# EAGLE design catropy (EAGLE 9.6.2)
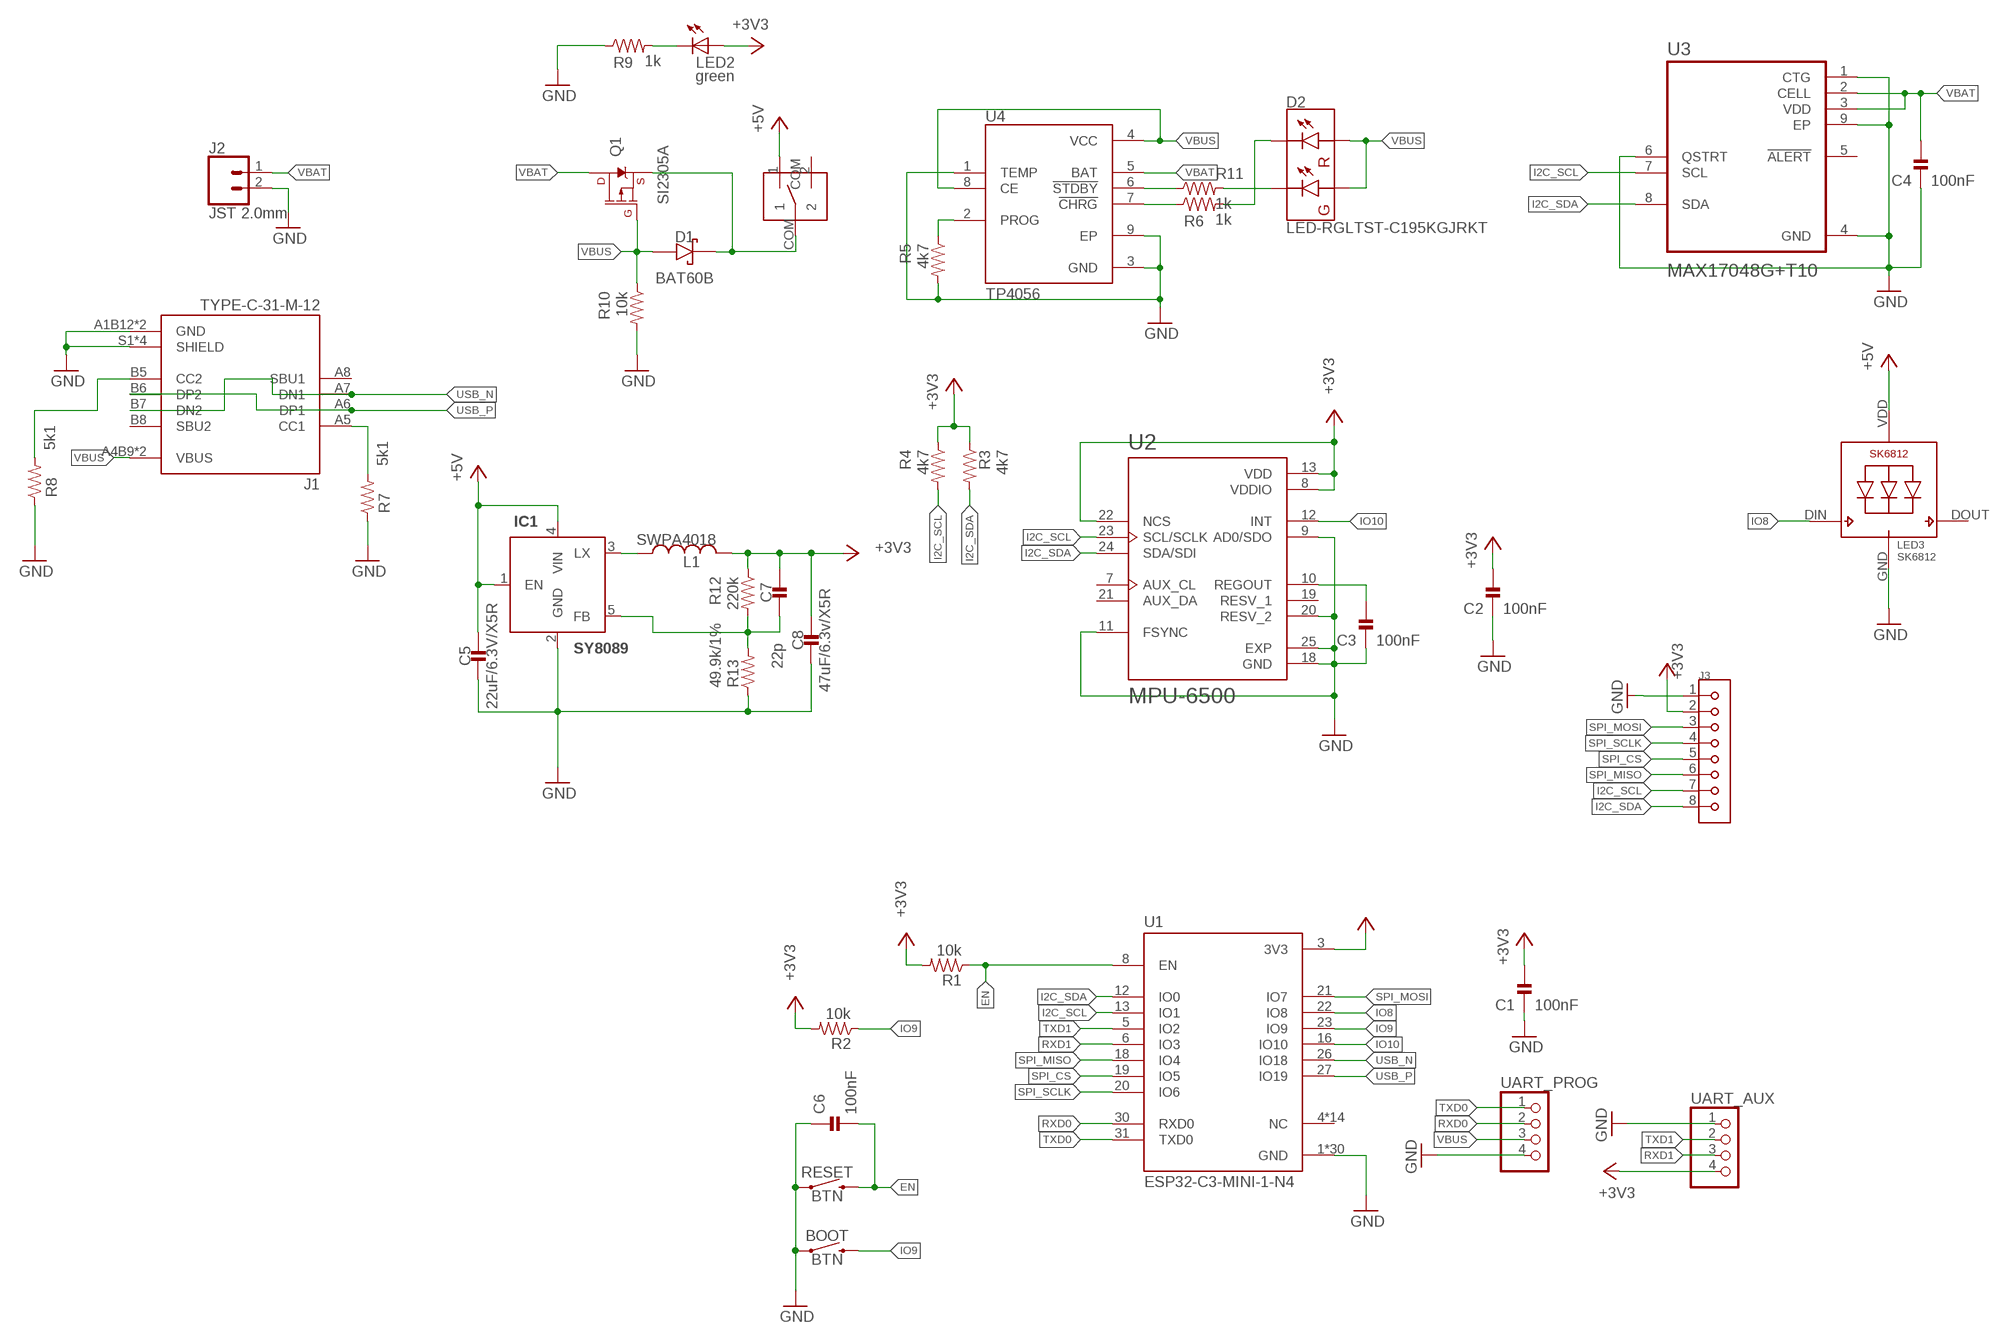
[diagram p0: schematic, sheet 1]

## Parts
BOOT  BTN  MOMENTARY-SWITCH-SPST-SMD-6.0X3.5MM  [TACTILE_SWITCH_SMD_6.0X3.5MM]
C1  100nF  CAPACITOR0402_CAP  [0402_CAP]
C2  100nF  CAPACITOR0402_CAP  [0402_CAP]
C3  100nF  CAPACITOR0402_CAP  [0402_CAP]
C4  100nF  CAPACITOR0402_CAP  [0402_CAP]
C5  22uF/6.3V/X5R  CAPACITOR0603_CAP  [0603_CAP]
C6  100nF  CAPACITOR0402_CAP  [0402_CAP]
C7  22p  CAPACITOR0402_CAP  [0402_CAP]
C8  47uF/6.3v/X5R  CAPACITOR0805_CAP  [0805_CAP]
D1  BAT60B  DIODE_SCHOTTKYSOD323  [SOD323]
D2  LED-RGLTST-C195KGJRKT  [LTST-C195KGJRKT]
IC1  SY8089  [SOT23-5]
J1  TYPE-C-31-M-12  [HRO_TYPE-C-31-M-12]
J2  JST 2.0mm  CONN_02-JST-2MM-SMT  [JST-2-SMD]
J3  SM08B-SRSS-TB(LF)(SN)  [JST_SM08B-SRSS-TB(LF)(SN)]
L1  SWPA4018  SWPA40XX  [SWPA40XX]
LED2  green  LEDCHIPLED_0603  [CHIPLED_0603]
LED3  SK6812  SK6812_EC3210R  [LED_EC3210R]
Q1  SI2305A  MOSFET_PCH-SI2309DS  [SOT23-3]
R1  10k  RESISTOR0402_RES  [0402_RES]
R2  10k  RESISTOR0402_RES  [0402_RES]
R3  4k7  RESISTOR0402_RES  [0402_RES]
R4  4k7  RESISTOR0402_RES  [0402_RES]
R5  4k7  RESISTOR0402_RES  [0402_RES]
R6  1k  RESISTOR0402_RES  [0402_RES]
R7  5k1  RESISTOR0402_RES  [0402_RES]
R8  5k1  RESISTOR0402_RES  [0402_RES]
R9  1k  RESISTOR0402_RES  [0402_RES]
R10  10k  RESISTOR0402_RES  [0402_RES]
R11  1k  RESISTOR0402_RES  [0402_RES]
R12  220k  RESISTOR0402_RES  [0402_RES]
R13  49.9k/1%  RESISTOR0402_RES  [0402_RES]
RESET  BTN  MOMENTARY-SWITCH-SPST-SMD-6.0X3.5MM  [TACTILE_SWITCH_SMD_6.0X3.5MM]
U1  ESP32-C3-MINI-1-N4  [XCVR_ESP32-C3-MINI-1-N4]
U2  MPU-6500  [QFN40P300X300X95-25N]
U3  MAX17048G+T10  [SON50P200X200X80-9N]
U4  TP4056  [SOP127P600X175-9N]
U$1  SK12D07VG4  [SK12D07VG4]
UART_AUX  PINHD-1X4  [1X04]
UART_PROG  PINHD-1X4  [1X04]

## Nets
5V_AUX: D1.P$1(CATHODE) Q1.2(S) U$1.COM
+3V3: C1.2 C2.2 C7.1 C8.P$1 J3.2 L1.P$2 LED2.A R1.2 R2.2 R3.1 R4.1 R12.1 U1.3(3V3) U2.8(VDDIO) U2.13(VDD) U2.22(NCS) UART_AUX.4
+5V: C5.1 IC1.1(EN) IC1.4(VIN) LED3.VDD U$1.1
EN: C6.2 R1.1 RESET.2 U1.8(EN)
GND: BOOT.1 C1.1 C2.1 C3.1 C4.1 C5.2 C6.1 C8.P$2 IC1.2(GND) J1.A1B12(GND) J1.B1A12(GND) J1.S1(SHIELD) J1.S2(SHIELD) J1.S3(SHIELD) J1.S4(SHIELD) J2.2 J3.1 LED3.GND R5.2 R7.1 R8.1 R9.1 R10.2 R13.1 RESET.1 U1.1(GND) U1.2(GND) U1.11(GND) U1.14(GND) U1.36(GND) U1.37(GND) U1.38(GND) U1.39(GND) U1.40(GND) U1.41(GND) U1.42(GND) U1.43(GND) U1.44(GND) U1.45(GND) U1.46(GND) U1.47(GND) U1.48(GND) U1.49_1(GND) U1.49_2(GND) U1.49_3(GND) U1.49_4(GND) U1.49_5(GND) U1.49_6(GND) U1.49_7(GND) U1.49_8(GND) U1.49_9(GND) U1.50(GND) U1.51(GND) U1.52(GND) U1.53(GND) U2.9(AD0/SDO) U2.11(FSYNC) U2.18(GND) U2.20(RESV_2) U2.25(EXP) U3.1(CTG) U3.4(GND) U3.6(QSTRT) U3.9(EP) U4.1(TEMP) U4.3(GND) U4.9(EP) UART_AUX.1 UART_PROG.4
I2C_SCL: J3.7 R4.2 U1.13(IO1) U2.23(SCL/SCLK) U3.7(SCL)
I2C_SDA: J3.8 R3.2 U1.12(IO0) U2.24(SDA/SDI) U3.8(SDA)
IO8: LED3.DIN(DI) U1.22(IO8)
IO9: BOOT.2 R2.1 U1.23(IO9)
IO10: U1.16(IO10) U2.12(INT)
N$1: R5.1 U4.2(PROG)
N$2: R6.1 U4.7(!CHRG)
N$3: J1.A5(CC1) R7.2
N$4: R11.1 U4.6(!STDBY)
N$5: D2.P$3(GC) R11.2
N$6: C7.2 IC1.5(FB) R12.2 R13.2
N$7: C3.2 U2.10(REGOUT)
N$8: IC1.3(LX) L1.P$1
N$12: D2.P$4(RC) R6.2
N$13: LED2.C R9.2
N$15: J1.B5(CC2) R8.2
RXD0: U1.30(RXD0) UART_PROG.2
RXD1: U1.6(IO3) UART_AUX.3
SPI_CS: J3.5 U1.19(IO5)
SPI_MISO: J3.6 U1.18(IO4)
SPI_MOSI: J3.3 U1.21(IO7)
SPI_SCLK: J3.4 U1.20(IO6)
TXD0: U1.31(TXD0) UART_PROG.1
TXD1: U1.5(IO2) UART_AUX.2
USB_N: J1.A7(DN1) J1.B7(DN2) U1.26(IO18)
USB_P: J1.A6(DP1) J1.B6(DP2) U1.27(IO19)
VBAT: C4.2 J2.1 Q1.3(D) U3.2(CELL) U3.3(VDD) U4.5(BAT)
VBUS: D1.P$2(ANODE) D2.P$1(GA) D2.P$2(RA) J1.A4B9(VBUS) J1.B4A9(VBUS) Q1.1(G) R10.1 U4.4(VCC) U4.8(CE) UART_PROG.3
Unconnected: J1.A8(SBU1) J1.B8(SBU2) LED3.DOUT(DO) U1.4(NC) U1.7(NC) U1.9(NC) U1.10(NC) U1.15(NC) U1.17(NC) U1.24(NC) U1.25(NC) U1.28(NC) U1.29(NC) U1.32(NC) U1.33(NC) U1.34(NC) U1.35(NC) U2.7(AUX_CL) U2.19(RESV_1) U2.21(AUX_DA) U3.5(!ALERT) U$1.2

## Library data of the parts
BOOT RESET = SparkFun-Switches:MOMENTARY-SWITCH-SPST: Momentary Switch (Pushbutton) - SPST Normally-open (NO) SPST momentary switches (buttons, pushbuttons). Variants PTH-12MM - 12mm square, through-hole Momentary Pushbutton Switch - 12mm Square <https://www.sparkfun.com/products/9190> (COM-09190) PTH-6.0MM, PTH-6.0MM-KIT - 6.0mm square, through-hole Mini Pushbutton Switch <https://www.sparkfun.com/products/97> (COM-00097) KIT package intended for soldering kit's - only one side of pads' copper is exposed. PTH-RIGHT-ANGLE-KIT - Right-angle, through-hole Right Angle Tactile Button <https://www.sparkfun.com/products/10791> - Used on SparkFun BigTime Watch Kit <https://www.sparkfun.com/products/11734> SMD-12MM - 12mm square, surface-mount Tactile Button - SMD (12mm) <https://www.sparkfun.com/products/12993> (COM-12993) Used on SparkFun PicoBoard <https://www.sparkfun.com/products/11888> SMD-4.5MM - 4.5mm Square Trackball Switch Used on SparkFun Blackberry Trackballer Breakout <https://www.sparkfun.com/products/13169> SMD-4.6MMX2.8MM - 4.60mm x 2.80mm, surface mount Used on SparkFun SAMD21 Mini Breakout <https://www.sparkfun.com/products/13664> SMD-5.2MM, SMD-5.2-REDUNDANT - 5.2mm square, surface-mount Mini Pushbutton Switch - SMD <https://www.sparkfun.com/products/8720> (COM-08720) Used on Arduino Pro Mini <https://www.sparkfun.com/products/11114> REDUNDANT package connects both switch circuits together SMD-6.0X3.5MM - 6.0 x 3.5mm, surface mount Momentary Reset Switch SMD <https://www.sparkfun.com/products/8229> (COM-08229) SMD-6.2MM-TALL - 6.2mm square, surface mount Tactile Button - SMD (6mm) <https://www.sparkfun.com/products/12992> Used on SparkFun Digital Sandbox <https://www.sparkfun.com/products/12651> SMD-RIGHT-ANGLE - Right-angle, surface mount Used on SparkFun Block for Intel® Edison - Arduino <https://www.sparkfun.com/products/13036>; LCSC_PART: C118141; PROD_ID: SWCH-00815; SF_SKU: COM-08229
C1-C8 = passives:CAPACITOR: SMD Capacitor
D1 = passives:DIODE_SCHOTTKY; LCSC_PART: C22638
D2 = SparkFun-LED:LED-RG: LiteOn Technology Corporation LTST-C195KGJRKT - LED GREEN/RED CLEAR 0606 SMD Color: Red/Green Lens Transparency: Clear Lens Style/Size: Rectangle with Flat top, 1.10 x 1.5 mm mC Rating45mcd Red, 35 mcd Green Current: 20mA Red, 20mA Green Forward Voltage: 2V Red, 2V Green Packages: 0606 SparkFun Products: Electric Imp imp002 Breakout <[https://www.sparkfun.com/products/12958]>; LCSC_PART: C125104; PROD_ID: DIO-12140
IC1 = SY8089:SY8089; LCSC_PART: C78988
J1 = TYPE-C-31-M-12:TYPE-C-31-M-12: USB Connectors 24 Receptacle 1 8.94*7.3mm RoHS Check availability <https://pricing.snapeda.com/parts/TYPE-C-31-M-12/HRO%20Electronics%20Co.%2C%20Ltd./view-part?ref=eda>; AVAILABILITY: Not in stock; DESCRIPTION: USB Connectors 24 Receptacle 1 8.94*7.3mm RoHS; LCSC_PART: C165948; MF: HRO Electronics Co., Ltd.; MP: TYPE-C-31-M-12; PACKAGE: Package; PRICE: None
J2 = SparkFun-Connectors:CONN_02: Multi connection point. Often used as Generic Header-pin footprint for 0.1 inch spaced/style header connections On any of the 0.1 inch spaced packages, you can populate with these: Break Away Headers - Straight <https://www.sparkfun.com/products/116> (PRT-00116) Break Away Male Headers - Right Angle <https://www.sparkfun.com/products/553> (PRT-00553) Female Headers <https://www.sparkfun.com/products/115> (PRT-00115) Break Away Headers - Machine Pin <https://www.sparkfun.com/products/117> (PRT-00117) Break Away Female Headers - Swiss Machine Pin <https://www.sparkfun.com/products/743> (PRT-00743) For SCREWTERMINALS and SPRING TERMINALS visit here: Screw Terimnals on SparkFun.com <https://www.sparkfun.com/search/results?term=Screw+Terminals> (5mm/3.5mm/2.54mm spacing) This device is also useful as a general connection point to wire up your design to another part of your project. Our various solder wires solder well into these plated through hole pads. Hook-Up Wire - Assortment (Stranded, 22 AWG) <https://www.sparkfun.com/products/11375> (PRT-11375) Hook-Up Wire - Assortment (Solid Core, 22 AWG) <https://www.sparkfun.com/products/11367> (PRT-11367) View the entire wire category on our website here <https://www.sparkfun.com/categories/141> Special notes: Molex polarized connector foot print use with: PRT-08233 with associated crimp pins and housings. 2.54_SCREWTERM for use with PRT-10571. 3.5mm Screw Terminal footprints for PRT-08084 5mm Screw Terminal footprints for use with PRT-08432; LCSC_PART: C3029440; PROD_ID: CONN-11443
J3 = SM08B-SRSS-TB_LF__SN_:SM08B-SRSS-TB(LF)(SN): SH Series 8 Position 1 mm Pitch Surface Mount Side Entry Shrouded Header Check availability <https://pricing.snapeda.com/parts/SM08B-SRSS-TB%28LF%29%28SN%29/JST%20Sales/view-part?ref=eda>; AVAILABILITY: In Stock; DESCRIPTION: Connector Header Surface Mount, Right Angle 8 position 0.039 (1.00mm); LCSC_PART: C160407; MF: JST Sales; MP: SM08B-SRSS-TB(LF)(SN); PACKAGE: None; PRICE: None; PURCHASE-URL: https://pricing.snapeda.com/search/part/SM08B-SRSS-TB(LF)(SN)/?ref=eda
L1 = swpa_inductor:SWPA40XX; LCSC_PART: C50543
LED2 = led:LED: LED OSRAM: - CHIPLED LG R971, LG N971, LY N971, LG Q971, LY Q971, LO R971, LY R971 LH N974, LH R974 LS Q976, LO Q976, LY Q976 LO Q996 - Hyper CHIPLED LW Q18S LB Q993, LB Q99A, LB R99A - SideLED LS A670, LO A670, LY A670, LG A670, LP A670 LB A673, LV A673, LT A673, LW A673 LH A674 LY A675 LS A676, LA A676, LO A676, LY A676, LW A676 LS A679, LY A679, LG A679 - Hyper Micro SIDELED® LS Y876, LA Y876, LO Y876, LY Y876 LT Y87S - SmartLED LW L88C, LW L88S LB L89C, LB L89S, LG L890 LS L89K, LO L89K, LY L89K LS L896, LA L896, LO L896, LY L896 - TOPLED LS T670, LO T670, LY T670, LG T670, LP T670 LSG T670, LSP T670, LSY T670, LOP T670, LYG T670 LG T671, LOG T671, LSG T671 LB T673, LV T673, LT T673, LW T673 LH T674 LS T676, LA T676, LO T676, LY T676, LB T676, LH T676, LSB T676, LW T676 LB T67C, LV T67C, LT T67C, LS T67K, LO T67K, LY T67K, LW E67C LS E67B, LA E67B, LO E67B, LY E67B, LB E67C, LV E67C, LT E67C LW T67C LS T679, LY T679, LG T679 LS T770, LO T770, LY T770, LG T770, LP T770 LB T773, LV T773, LT T773, LW T773 LH T774 LS E675, LA E675, LY E675, LS T675 LS T776, LA T776, LO T776, LY T776, LB T776 LHGB T686 LT T68C, LB T68C - Hyper Mini TOPLED® LB M676 - Mini TOPLED Santana® LG M470 LS M47K, LO M47K, LY M47K Source: http://www.osram.convergy.de LUXEON: - LUMILED® LXK2-PW12-R00, LXK2-PW12-S00, LXK2-PW14-U00, LXK2-PW14-V00 LXK2-PM12-R00, LXK2-PM12-S00, LXK2-PM14-U00 LXK2-PE12-Q00, LXK2-PE12-R00, LXK2-PE12-S00, LXK2-PE14-T00, LXK2-PE14-U00 LXK2-PB12-K00, LXK2-PB12-L00, LXK2-PB12-M00, LXK2-PB14-N00, LXK2-PB14-P00, LXK2-PB14-Q00 LXK2-PR12-L00, LXK2-PR12-M00, LXK2-PR14-Q00, LXK2-PR14-R00 LXK2-PD12-Q00, LXK2-PD12-R00, LXK2-PD12-S00 LXK2-PH12-R00, LXK2-PH12-S00 LXK2-PL12-P00, LXK2-PL12-Q00, LXK2-PL12-R00 Source: www.luxeon.com KINGBRIGHT: KA-3528ASYC Source: www.kingbright.com; LCSC_PART: C72043
LED3 = SK6812:SK6812; LCSC_PART: C2890041
Q1 = SparkFun-DiscreteSemi:MOSFET_PCH: P-channel MOSFETs Voltage controlled devices that allow control of high current outputs. SparkFun Products: SparkFun ESP32 Thing <https://www.sparkfun.com/products/13907> SparkFun ESP8266 Thing <https://www.sparkfun.com/products/13231> SparkFun Pi Servo HAT V2 <https://www.sparkfun.com/products/15316> DMG2305UX-7 (20V/4.2A/SOT23-3); LCSC_PART: C347488; PROD_ID: TRANS-08285; VALUE: 1.1A/60V/600mΩ
R1-R12 = passives:RESISTOR: Resistor Basic schematic elements and footprints for 0201, 0402, 0603, 1206, and PTH resistors.
R13 = passives:RESISTOR: Resistor Basic schematic elements and footprints for 0201, 0402, 0603, 1206, and PTH resistors.; LCSC_PART: C208898
U1 = ESP32-C3-MINI-1-N4:ESP32-C3-MINI-1-N4: Check availability <https://pricing.snapeda.com/parts/ESP32-C3-MINI-1-N4/Espressif%20Systems/view-part?ref=eda>; AVAILABILITY: In Stock; DESCRIPTION: Bluetooth, WiFi 802.11b/g/n, Bluetooth v5.0 Transceiver Module 2.412GHz ~ 2.484GHz PCB Trace Surface Mount; LCSC_PART: C2838502; MF: Espressif Systems; MP: ESP32-C3-MINI-1-N4; PACKAGE: SMD-53 Espressif Systems; PRICE: None; PURCHASE-URL: https://pricing.snapeda.com/search/part/ESP32-C3-MINI-1-N4/?ref=eda
U2 = MPU-6500:MPU-6500: Accelerometer, Gyroscope, 6 Axis Sensor I²C, SPI Output Check availability <https://pricing.snapeda.com/parts/MPU-6500/TDK%20InvenSense/view-part?ref=eda>; AVAILABILITY: In Stock; DESCRIPTION: Accelerometer, Gyroscope, 6 Axis Sensor I²C, SPI Output; LCSC_PART: C50278; MF: TDK InvenSense; MP: MPU-6500; PACKAGE: None; PRICE: None; PURCHASE-URL: https://pricing.snapeda.com/search/part/MPU-6500/?ref=eda
U3 = MAX17048G_T10:MAX17048G+T10: Check availability <https://pricing.snapeda.com/parts/MAX17048G%2BT10/Analog%20Devices/view-part?ref=eda>; AVAILABILITY: In Stock; DESCRIPTION: 3µA 1-Cell/2-Cell Fuel Gauge with ModelGauge; LCSC_PART: C2682616; MF: Analog Devices; MP: MAX17048G+T10; PACKAGE: TDFN-8 Maxim; PRICE: None; PURCHASE-URL: https://pricing.snapeda.com/search/part/MAX17048G+T10/?ref=eda
U4 = TP4056:TP4056: Complete single cell Li-Ion battery with a constant current / constant voltage linear charger Check availability <https://pricing.snapeda.com/parts/TP4056/NanJing%20Top%20Power%20ASIC%20Corp./view-part?ref=eda>; AVAILABILITY: Not in stock; DESCRIPTION: Complete single cell Li-Ion battery with a constant current / constant voltage linear charger; MF: NanJing Top Power ASIC Corp.; MP: TP4056; PACKAGE: Package; PRICE: None
U$1 = SK12D07VG4:SK12D07VG4: SPDT switch LCSC very cheap Check availability <https://pricing.snapeda.com/parts/SK12D07VG4/C%26K/view-part?ref=eda>; AVAILABILITY: In Stock; DESCRIPTION: Switch Slide ON ON SPDT Side Slide 0.3A 30VDC PC Pins Bracket Mount/Through Hole Bulk; LCSC_PART: C393937; MF: C&K; MP: SK12D07VG4; PACKAGE: None; PRICE: None; PURCHASE-URL: https://pricing.snapeda.com/search/part/SK12D07VG4/?ref=eda
UART_AUX UART_PROG = pinhead:PINHD-1X4: PIN HEADER

## Net classes
0 default: width 0.152 mm
1 supply: width 0.203 mm

## Board
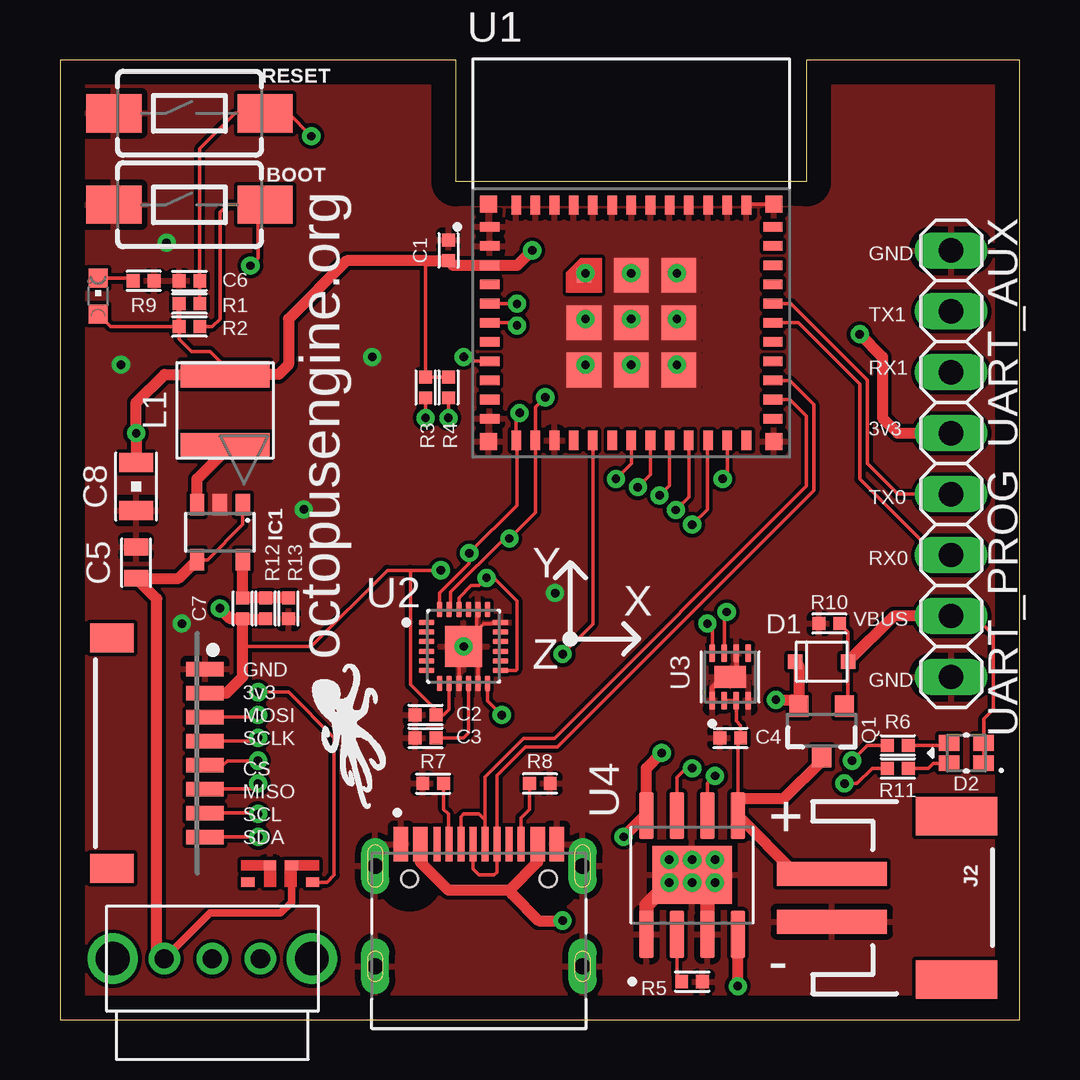
[diagram p1: board, top side]
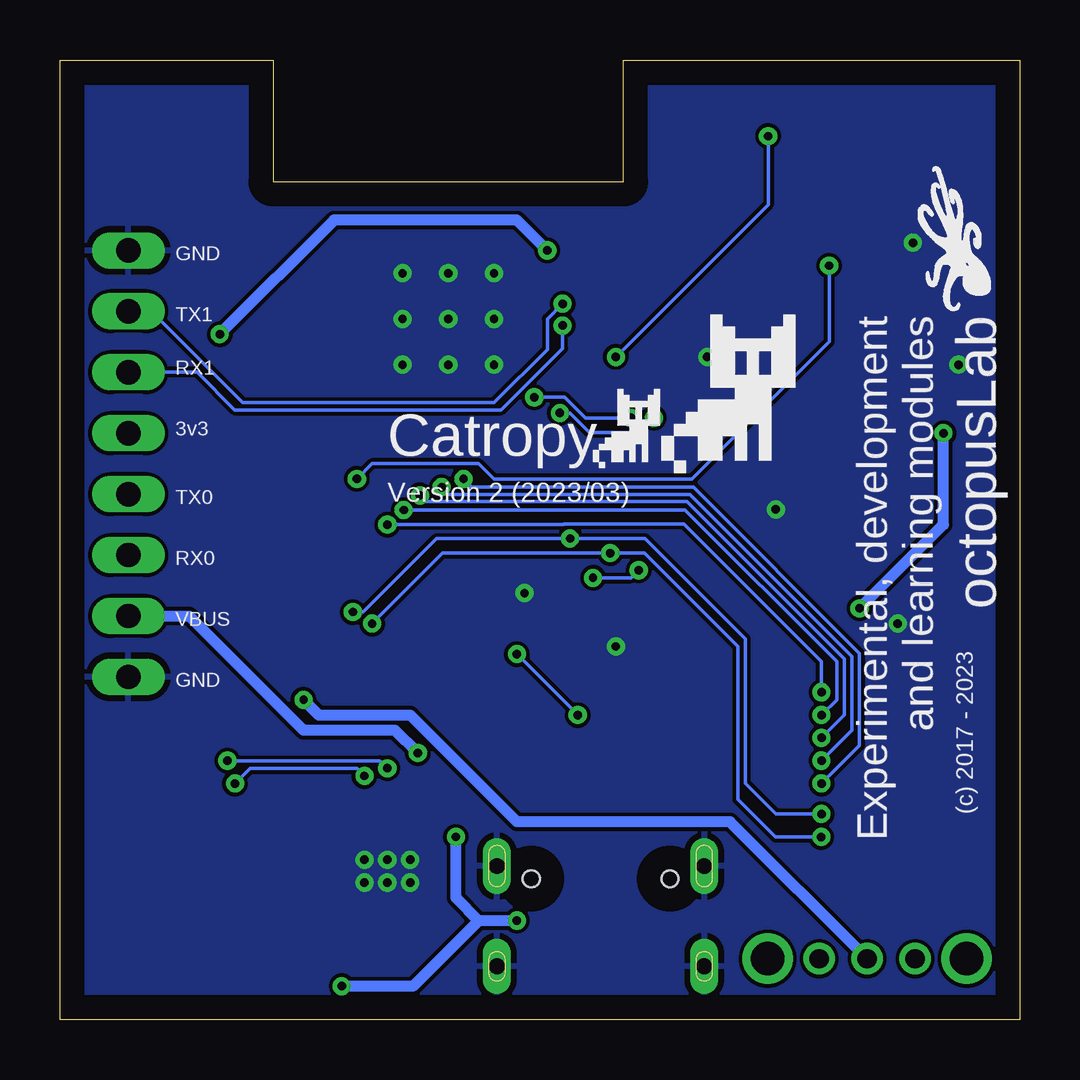
[diagram p2: board, bottom side, seen from below]

Size 40 x 40.01 mm. Coordinates in mm from the lower left corner, seen from the top.
Outline: 40,0 40,40 31.11,40.01 31.11,34.92 16.51,34.92 16.51,40 0,40 0,0 40,0
Copper layers (1*16): Top 0.035mm / dielectric 1.5mm / Bottom 0.035mm
Design rules "default *": minimum track width 6mil, minimum drill 0.35mm, track to track 6mil, track to pad 6mil, pad to pad 6mil, via to via 6mil, smd to smd 6mil, copper to edge 40mil, drill to drill 6mil, minimum pad ring 10mil, minimum via ring 8mil, stop-mask expansion 4mil, vias tented up to drill 15mil, thermal gap 10mil
Holes 3.5 mm at 24.54,45.66

### Footprints (pad centres in the part's own frame; a part is rotated, then mirrored left to right if it is on the bottom)
TACTILE_SWITCH_SMD_6.0X3.5MM = smd 2.3 x 1.6: 1 -3.15,0; 2 3.15,0
0402_CAP = smd 0.536 x 0.546: 1 -0.433,0; 2 0.433,0
0603_CAP = smd 0.7 x 1: 1 -0.65,0; 2 0.65,0
0805_CAP = smd 0.8 x 1.4: P$1 1,0; P$2 -1,0
SOD323 = smd 0.6 x 0.6: P$1 -1.1,0; P$2 1.1,0
LTST-C195KGJRKT = smd 0.85 x 0.65: P$1 -0.725,0.425; P$2 -0.725,-0.425; P$3 0.725,0.425; P$4 0.725,-0.425
SOT23-5 = smd 0.9 x 0.6: 1 -1.15,0.95; 2 -1.15,0; 3 -1.15,-0.95; 4 1.15,-0.95; 5 1.15,0.95
HRO_TYPE-C-31-M-12 = smd 0.6 x 1.45: A1B12 -3.25,5.095; A4B9 -2.45,5.095; B1A12 3.25,5.095; B4A9 2.45,5.095 | smd 0.3 x 1.45: A5 -1.25,5.095; A6 -0.25,5.095; A7 0.25,5.095; A8 1.25,5.095; B5 1.75,5.095; B6 0.75,5.095; B7 -0.75,5.095; B8 -1.75,5.095 | drill 0.65 pad 1.05 long: S1 -4.32,4.18; S2 4.32,4.18; S3 -4.32,0; S4 4.32,0 | hole 0.7: -2.89,3.65; 2.89,3.65
JST-2-SMD = smd 1 x 4.6: 1 -1,-3.7; 2 1,-3.7 | smd 1.6 x 3.4: NC1 -3.4,1.5; NC2 3.4,1.5
JST_SM08B-SRSS-TB(LF)(SN) = smd 0.6 x 1.55: 1 -3.5,4.775; 2 -2.5,4.775; 3 -1.5,4.775; 4 -0.5,4.775; 5 0.5,4.775; 6 1.5,4.775; 7 2.5,4.775; 8 3.5,4.775 | smd 1.2 x 1.8: P1 -4.8,0.9; P2 4.8,0.9
SWPA40XX = smd 1.1 x 3.7: P$1 -1.5,0.1; P$2 1.5,0.1
CHIPLED_0603 = smd 0.8 x 0.8: A 0,-0.75; C 0,0.75
LED_EC3210R = smd 0.55 x 0.4: DIN 1.325,-0.3; DOUT -1.375,-0.3; VDD 0.45,0.4 | smd 0.5 x 0.4: GND -0.45,0.4
SOT23-3 = smd 0.8 x 0.9: 1 -0.95,-1; 2 0.95,-1; 3 0,1.1
0402_RES = smd 0.536 x 0.546: 1 -0.433,0; 2 0.433,0
XCVR_ESP32-C3-MINI-1-N4 = smd 0.8 x 0.4: 1 -5.9,1.3; 2 -5.9,0.5; 3 -5.9,-0.3; 4 -5.9,-1.1; 5 -5.9,-1.9; 6 -5.9,-2.7; 7 -5.9,-3.5; 8 -5.9,-4.3; 9 -5.9,-5.1; 10 -5.9,-5.9; 11 -5.9,-6.7; 25 5.9,-6.7; 26 5.9,-5.9; 27 5.9,-5.1; 28 5.9,-4.3; 29 5.9,-3.5; 30 5.9,-2.7; 31 5.9,-1.9; 32 5.9,-1.1; 33 5.9,-0.3; 34 5.9,0.5; 35 5.9,1.3 | smd 0.4 x 0.8: 12 -4.8,-7.6; 13 -4,-7.6; 14 -3.2,-7.6; 15 -2.4,-7.6; 16 -1.6,-7.6; 17 -0.8,-7.6; 18 0,-7.6; 19 0.8,-7.6; 20 1.6,-7.6; 21 2.4,-7.6; 22 3.2,-7.6; 23 4,-7.6; 24 4.8,-7.6; 36 4.8,2.2; 37 4,2.2; 38 3.2,2.2; 39 2.4,2.2; 40 1.6,2.2; 41 0.8,2.2; 42 0,2.2; 43 -0.8,2.2; 44 -1.6,2.2; 45 -2.4,2.2; 46 -3.2,2.2; 47 -4,2.2; 48 -4.8,2.2 | smd 0.6 x 0.6: 49_1 -1.975,-0.725 | smd 1.45 x 1.45: 49_2 0,-0.725; 49_3 1.975,-0.725; 49_4 1.975,-2.7; 49_5 1.975,-4.675; 49_6 0,-4.675; 49_7 -1.975,-4.675; 49_8 -1.975,-2.7; 49_9 0,-2.7 | smd 0.7 x 0.7: 50 5.95,2.25; 51 5.95,-7.65; 52 -5.95,-7.65; 53 -5.95,2.25
QFN40P300X300X95-25N = smd 0.64 x 0.22: 1 -1.545,1; 2 -1.545,0.6; 3 -1.545,0.2; 4 -1.545,-0.2; 5 -1.545,-0.6; 6 -1.545,-1; 13 1.545,-1; 14 1.545,-0.6; 15 1.545,-0.2; 16 1.545,0.2; 17 1.545,0.6; 18 1.545,1 | smd 0.22 x 0.64: 7 -1,-1.545; 8 -0.6,-1.545; 9 -0.2,-1.545; 10 0.2,-1.545; 11 0.6,-1.545; 12 1,-1.545; 19 1,1.545; 20 0.6,1.545; 21 0.2,1.545; 22 -0.2,1.545; 23 -0.6,1.545; 24 -1,1.545 | smd 1.54 x 1.7: 25 0,0
SON50P200X200X80-9N = smd 0.76 x 0.27: 1 -0.985,0.75; 2 -0.985,0.25; 3 -0.985,-0.25; 4 -0.985,-0.75; 5 0.985,-0.75; 6 0.985,-0.25; 7 0.985,0.25; 8 0.985,0.75 | smd 0.9 x 1.3: 9 0,0
SOP127P600X175-9N = smd 1.97 x 0.6: 1 -2.475,1.905; 2 -2.475,0.635; 3 -2.475,-0.635; 4 -2.475,-1.905; 5 2.475,-1.905; 6 2.475,-0.635; 7 2.475,0.635; 8 2.475,1.905 | smd 2.413 x 3.302: 9 0,0
SK12D07VG4 = drill 0.8: 1 -2,0; 2 2,0; COM 0,0 | drill 1.4: M1 -4.15,0; M2 4.15,0
1X04 = drill 1.016 long: 1 -3.81,0; 2 -1.27,0; 3 1.27,0; 4 3.81,0

### Placement (x,y rotation side)
BOOT  5.4,33.97 0 top
C1  16.19,32.07 270 top
C2  15.24,12.7 0 top
C3  15.24,11.75 0 top
C4  27.94,11.75 0 top
C5  3.17,19.05 90 top
C6  5.4,30.8 0 top
C7  7.62,17.14 90 top
C8  3.17,22.23 90 top
D1  31.75,14.92 0 top
D2  37.78,11.11 180 top
IC1  6.67,20.32 270 top
J1  17.46,2.22 0 top
J2  35.88,5.08 270 top
J3  1.27,11.11 270 top
L1  6.99,25.4 90 top
LED2  1.59,30.16 0 top
LED3  9.21,6.03 0 top
Q1  31.75,12.06 180 top
R1  5.4,29.84 180 top
R2  5.4,28.89 180 top
R3  15.24,26.35 270 top
R4  16.19,26.35 270 top
R5  26.35,1.59 0 top
R6  34.92,11.43 0 top
R7  15.56,9.84 0 top
R8  20,9.84 180 top
R9  3.49,30.8 180 top
R10  32.07,16.51 180 top
R11  34.92,10.48 0 top
R12  8.57,17.14 90 top
R13  9.53,17.14 90 top
RESET  5.4,37.78 0 top
U1  23.81,31.75 0 top
U2  16.83,15.56 0 top
U3  27.94,14.29 90 top
U4  26.35,6.03 90 top
U$1  6.35,2.54 0 top
U$2  [OCTOPUSLAB]  7.1,36.33 90 top
U$3  [OCTOPUSENGINE]  14.2,8.67 90 top
U$4  [CATROPY_20]  16.19,22.54 0 bottom
U$5  [CATROPY_10]  18.41,22.86 0 bottom
UART_AUX  37.15,28.26 270 top
UART_PROG  37.15,18.1 270 top

### Tracks (layer width: path | path; a pad name or v marks a point on that pad's centre or on a via)
5V_AUX  (via drill 0.35)
  Top 0.457: D1.P$1 30.8,14.77 Q1.2 30.53,13.34 v29.84,13.34
  Bottom 0.457: U$1.COM 12.06,8.26 20.95,8.26 25.4,12.7 29.21,12.7 v29.84,13.34
+3V3  (via drill 0.35)
  Top 0.152: U2.8 16.23,12.94 15.99,12.7 C2.2 15.67,12.9 14.61,13.97 14.61,18.73 | 14.61,18.73 v15.88,18.73 | U2.22 16.63,17.58 17.14,18.1 17.46,18.1 v17.78,18.41 18.1,18.41 19.05,17.46 19.05,14.61 19,14.56 U2.13 | LED2.A 2.11,28.89 R2.2 4.96,28.37 5.49,27.85 6.25,27.85 6.88,27.22 L1.P$2 | R4.1 R3.1 15.24,31.63 | 7.62,15.56 10.48,15.56 13.65,18.73 14.61,18.73
  Top 0.203: R2.2 R1.2
  Top 0.305: C1.2 16.38,31.45
  Top 0.457: C1.2 15.24,31.63 11.95,31.63 9.53,29.21 9.53,27.3 9.12,26.9 L1.P$2 4.36,26.9 3.17,25.72 v3.17,24.45 C8.P$1 | 16.38,31.45 U1.3 19.07,31.45 v19.68,32.07 | v33.34,28.57 34.29,27.62 34.29,25.08 34.92,24.45 UART_AUX.4 | C7.1 R12.1 | J3.2 6.95,13.61 7.62,14.29 7.62,15.56 C7.1 | C7.1 7.1,16.71 v6.67,17.14
  Bottom 0.152: v15.88,18.73 16.19,18.41 v17.78,18.41
  Bottom 0.457: v19.68,32.07 20.95,33.34 28.57,33.34 v33.34,28.57 | v6.67,17.14 3.17,20.64 v3.17,24.45
+5V
  Top 0.152: IC1.4 6.15,19.17 7.62,20.64 IC1.1
  Top 0.305: U$1.1 6.25,4.45 9.21,4.45 9.66,4.89 LED3.VDD
  Top 0.457: U$1.1 4.03,2.86 4.03,17.54 C5.1 4.95,18.4 IC1.4
EN  (via drill 0.35)
  Top 0.152: R1.1 C6.2 5.83,36.31 7.3,37.78 RESET.2 9.53,37.78 v10.48,36.83 | U1.8 17,27.45 v16.83,27.62
  Bottom 0.152: v10.48,36.83 10.48,33.97 v16.83,27.62
GND  (via drill 0.35)
  Top 0.152: U2.9 16.63,15.36 U2.25 | U2.20 17.43,16.79 17.37,16.72 17.37,16.39 16.83,15.85 U2.25 | U2.18 18.05,16.56 17.99,16.5 17.66,16.5 16.83,15.67 U2.25 | U2.11 17.43,14.89 17.46,14.92 U2.25 | U1.36 28.66,34 U1.50
  Top 0.203: U3.6 28.19,14.54 U3.9 27.62,14.29 27.19,13.86 U3.1
  Top 0.61: U4.1 24.45,4.76 v25.4,5.71 25.72,5.71 26.04,6.03 U4.9 v26.35,5.71 26.99,5.08 U4.3
  other vias: 16.83,15.56 10.16,21.27 5.08,16.51 4.45,32.38 25.4,6.67 26.35,6.67 27.3,6.67 27.3,5.71 21.91,31.11 23.81,31.11 25.72,31.11 21.91,29.21 23.81,29.21 25.72,29.21 21.91,27.3 23.81,27.3 25.72,27.3 13.02,27.62 20.64,17.78 2.54,27.3
  pour Bottom: 0.32,39.69 39.69,39.69 39.69,0.32 0.32,0.32
  pour Top: 0.32,39.69 0.32,0.32 39.69,0.32 39.69,39.69
  pour Top (no thermals): 20.64,32.07 26.67,32.07 26.67,26.04 20.64,26.04
I2C_SCL  (via drill 0.35)
  Top 0.152: U2.23 16.29,17.16 16.29,17.82 18.53,20.06 v18.73,20.06 19.81,21.14 U1.13 19.81,25.53 v20.23,25.95 | U3.7 27.69,16.89 v27.79,16.99 | J3.7 8.21,8.61 v8.26,8.57 8.57,8.57 | R4.2 v16.19,25.08
  Bottom 0.152: v27.79,16.99 27.36,16.99 24.3,20.06 v18.73,20.06 15.61,20.06 11.43,15.88 11.43,9.84 10.16,8.57 v8.26,8.57 | v16.19,25.08 18.1,25.08 18.96,25.95 v20.23,25.95
I2C_SDA  (via drill 0.35)
  Top 0.152: U2.24 15.83,17.79 17.06,19.02 v17.06,19.45 19.05,21.44 19.05,24.11 U1.12 19.01,25.14 v19.16,25.29 | U3.8 27.19,16.31 v26.99,16.51 | J3.8 v8.26,7.61 | R3.2 v15.24,25.08
  Bottom 0.152: v26.99,16.51 24.05,19.45 v17.06,19.45 15.64,19.45 11.75,15.56 11.75,9.19 10.17,7.61 v8.26,7.61 | v15.24,25.08 15.33,25.08 15.94,24.48 17.92,24.48 18.73,25.29 v19.16,25.29
IO8  (via drill 0.35)
  Top 0.152: v8.26,13.65 9.53,13.65 11.43,11.75 11.43,6.03 11.13,5.73 LED3.DIN | v26.35,20.64 26.99,21.27 26.99,24.12 U1.22
  Bottom 0.152: v8.26,13.65 8.26,14.92 14,20.66 18.98,20.66 19.01,20.64 v26.35,20.64
IO9  (via drill 0.35)
  Top 0.152: R2.1 6.35,28.89 6.67,29.21 6.67,33.66 6.99,33.97 8.26,33.97 | 8.26,33.97 BOOT.2 | v7.94,31.43 8.26,31.75 8.26,33.97 | v27.62,22.54 27.81,22.73 U1.23
  Bottom 0.152: v7.94,31.43 7.94,28.26 13.65,22.54 21.91,22.54 22.54,23.18 26.99,23.18 v27.62,22.54
IO10  (via drill 0.35)
  Top 0.152: v18.41,12.7 17.83,13.29 U2.12 | U1.16 22.21,16.5 v20.95,15.24
  Bottom 0.152: v20.95,15.24 v18.41,12.7
N$1
  Top 0.152: R5.1 25.92,1.7 25.72,1.91 U4.2
N$2  (via drill 0.35)
  Top 0.152: U4.7 25.72,10.1 26.1,10.48 v26.35,10.48 | v33.02,10.79 33.66,11.43 R6.1
  Bottom 0.152: v33.02,10.79 26.67,10.79 v26.35,10.48
N$3
  Top 0.152: J1.A5 16.19,7.34 16.19,8.57 15.99,8.77 R7.2
N$4  (via drill 0.35)
  Top 0.152: U4.6 26.99,9.84 v27.3,10.16 | v32.7,9.84 33.22,9.84 33.86,10.48 R11.1
  Bottom 0.152: v32.7,9.84 32.07,10.48 27.62,10.48 v27.3,10.16
N$5
  Top 0.152: R11.2 36.2,10.48 36.41,10.69 D2.P$3
N$6
  Top 0.457: R13.2 R12.2 C7.2 IC1.5
N$7
  Top 0.152: C3.2 16.83,11.75 17.03,11.95 U2.10
N$8
  Top 0.457: L1.P$1 6.88,23.71 5.72,22.55 IC1.3
N$12
  Top 0.152: D2.P$4 36.95,11.43 R6.2
N$13
  Top 0.152: LED2.C 2.94,30.91 R9.2
N$15
  Top 0.152: J1.B5 19.21,8.42 19.57,8.77 R8.2
RXD0
  Top 0.152: U1.30 30.79,29.05 33.34,26.5 33.34,22.54 36.51,19.37 UART_PROG.2
RXD1  (via drill 0.35)
  Top 0.152: U1.6 18.94,29.05 v19.05,28.94
  Bottom 0.152: v19.05,28.94 19.05,27.98 21.62,25.41 32.72,25.41 34.29,26.99 UART_AUX.3
SPI_CS  (via drill 0.35)
  Top 0.152: v8.26,10.79 6.99,10.79 6.8,10.61 J3.5 | v24.09,22.2 24.61,22.72 U1.19
  Bottom 0.152: v8.26,10.79 6.99,12.06 6.99,15.15 13.73,21.89 23.79,21.89 v24.09,22.2
SPI_MISO  (via drill 0.35)
  Top 0.152: v8.26,9.84 8.03,9.61 J3.6 | v23.18,22.54 23.81,23.18 U1.18
  Bottom 0.152: v23.18,22.54 22.84,22.2 13.6,22.2 6.67,15.26 6.67,11.43 v8.26,9.84
SPI_MOSI  (via drill 0.35)
  Top 0.152: J3.3 8.17,12.61 v8.26,12.7 | U1.21 26.21,21.78 v25.67,21.24
  Bottom 0.152: v8.26,12.7 7.62,13.34 7.62,14.92 13.94,21.24 v25.67,21.24
SPI_SCLK  (via drill 0.35)
  Top 0.152: v8.26,11.75 8.12,11.61 J3.4 | v25,21.85 25.41,22.27 U1.20
  Bottom 0.152: v25,21.85 25,21.59 13.86,21.59 7.3,15.04 7.3,12.7 v8.26,11.75
TXD0
  Top 0.152: U1.31 30.48,29.85 33.66,26.67 33.66,23.18 34.92,21.91 UART_PROG.1
TXD1  (via drill 0.35)
  Top 0.152: U1.5 v19.05,29.85 v19.05,29.84
  Bottom 0.152: v19.05,29.84 19.68,29.21 19.68,27.94 21.91,25.72 32.38,25.72 36.2,29.53 UART_AUX.2
USB_N
  Top 0.152: J1.B7 16.71,8.46 16.83,8.57 17.46,8.57 17.71,8.32 J1.A7 17.71,10.11 19.33,11.73 20.61,11.73 31.11,22.24 31.11,25.15 30.42,25.85 U1.26
USB_P
  Top 0.152: J1.A6 17.21,6.28 17.46,6.03 18.1,6.03 18.21,6.15 J1.B6 18.21,10.18 19.41,11.38 20.74,11.38 31.42,22.06 31.42,25.65 30.42,26.65 U1.27
VBAT
  Top 0.152: U4.5 28.26,8.89 | 28.26,9.21 28.26,11.63 C4.2 28.37,12.27 28.19,12.45 U3.3 U3.2
  Top 0.305: 28.26,9.21 28.26,8.89
  Top 0.457: 30.37,6.08 J2.1 30.68,6.08 U4.5 28.26,8.57 | 28.26,9.21 30.16,9.21 31.75,10.79 Q1.3
VBUS  (via drill 0.35)
  Top 0.152: UART_PROG.3 38.1,16.83 38.9,16.03 38.9,12.93 38.51,12.53 D2.P$2 D2.P$1 | Q1.1 32.97,13.34 | 32.85,13.21 D1.P$2 32.85,16.16 R10.1
  Top 0.305: J1.A4B9 15.01,6.58 | J1.B4A9 19.91,6.58 | 18.73,5.4 18.83,5.3 18.83,5.24 | 24.38,8.51 U4.8
  Top 0.457: 15.01,6.58 16.19,5.4 18.73,5.4 19.91,6.58 | 18.83,5.24 19.95,4.13 v20.95,4.13 | v28.26,1.39 U4.4 | v23.5,7.62 24.38,8.51 | U4.8 24.45,10.48 v25.08,11.11 | D1.P$2 34.76,16.83 UART_PROG.3 | Q1.1 32.85,13.21
  Bottom 0.457: v20.95,4.13 22.54,4.13 | v28.26,1.39 25.28,1.39 22.54,4.13 | 22.54,4.13 23.5,5.08 v23.5,7.62 | v25.08,11.11 26.04,12.06 29.84,12.06 34.61,16.83 UART_PROG.3

### Text on the board
tPlace: Y | X | Z | + | -
tNames: GND | TX1 | RX1 | 3v3 | TX0 | RX0 | VBUS | GND | 3v3 | GND | MOSI | SCLK | CS | MISO | SCL | SDA
bNames: GND | TX1 | RX1 | 3v3 | Catropy | Version 2 (2023/03) | TX0 | RX0 | VBUS | GND